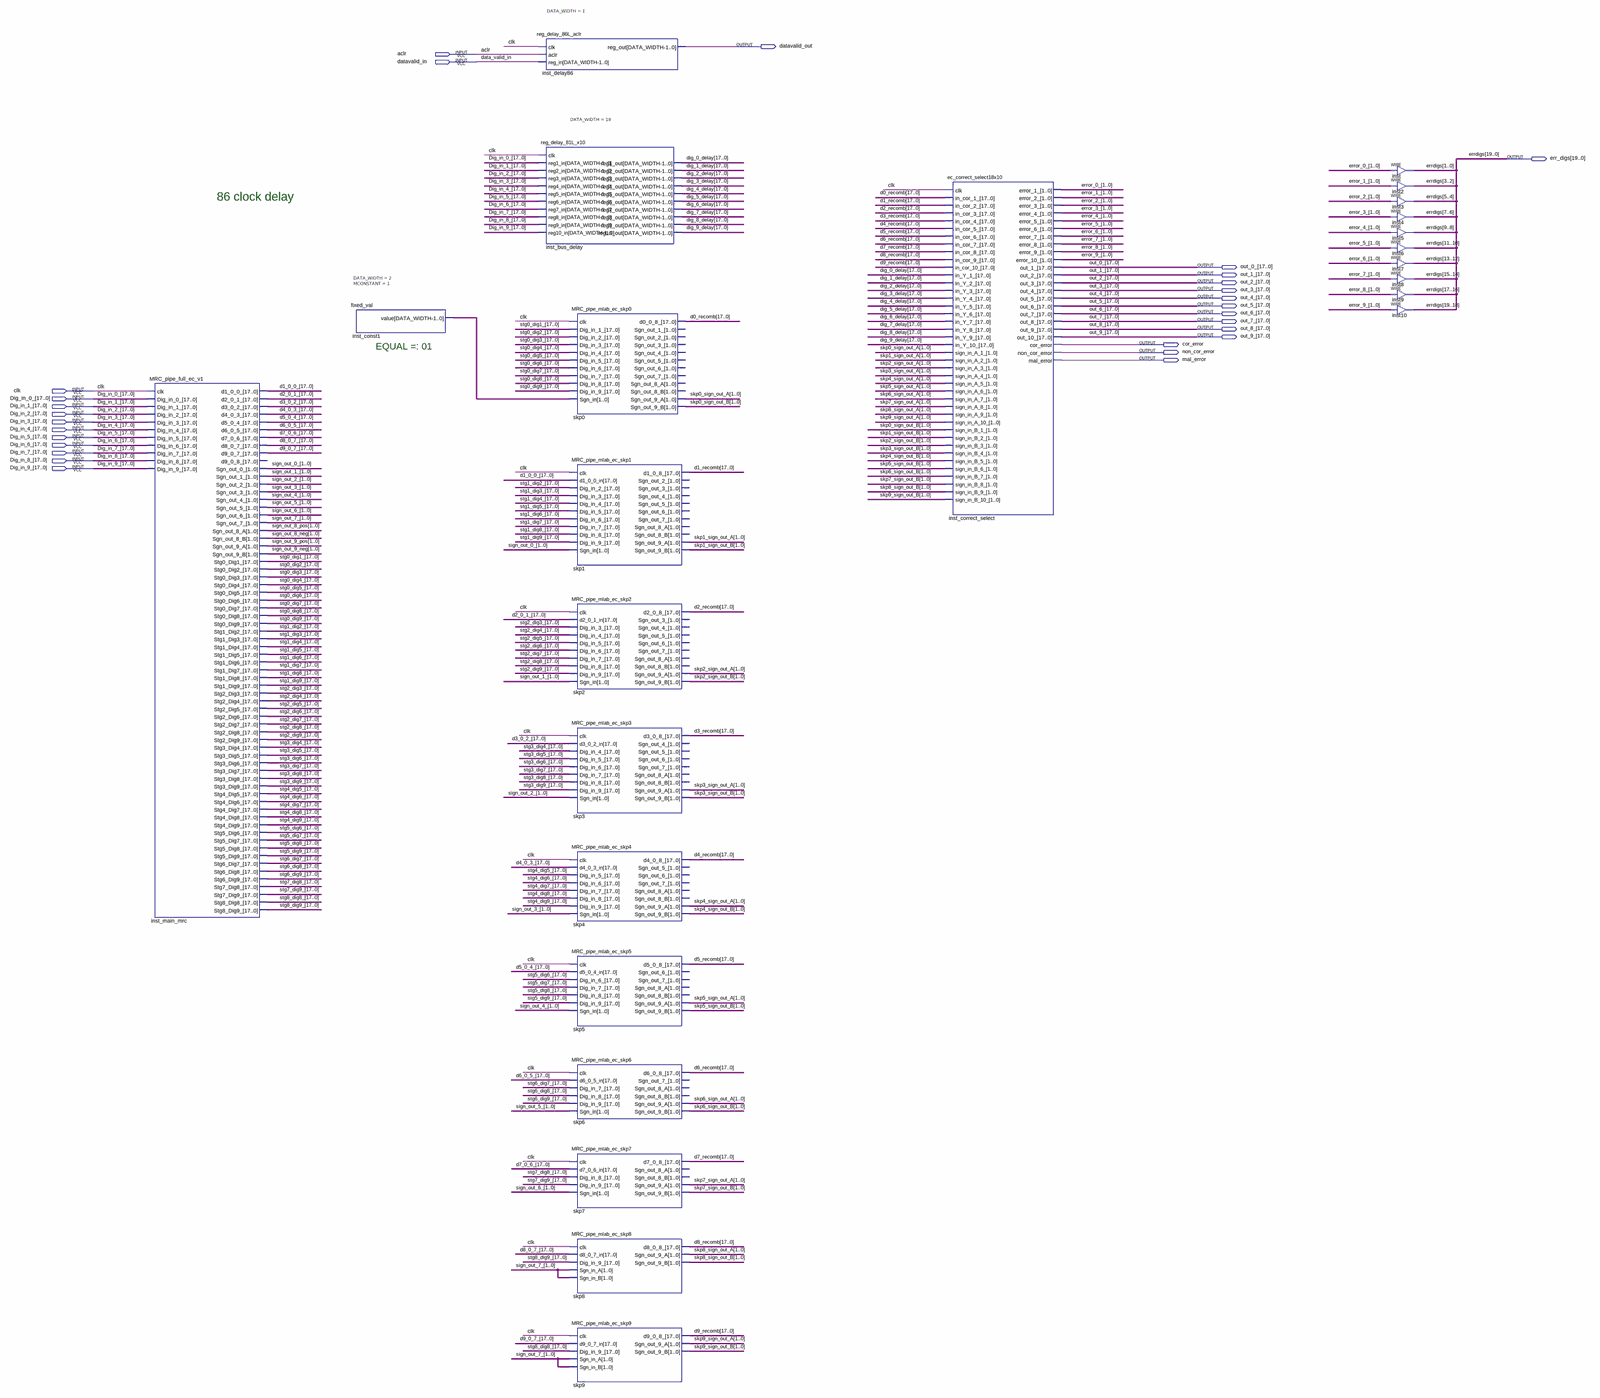
[diagram p0: schematic sheet, whole]
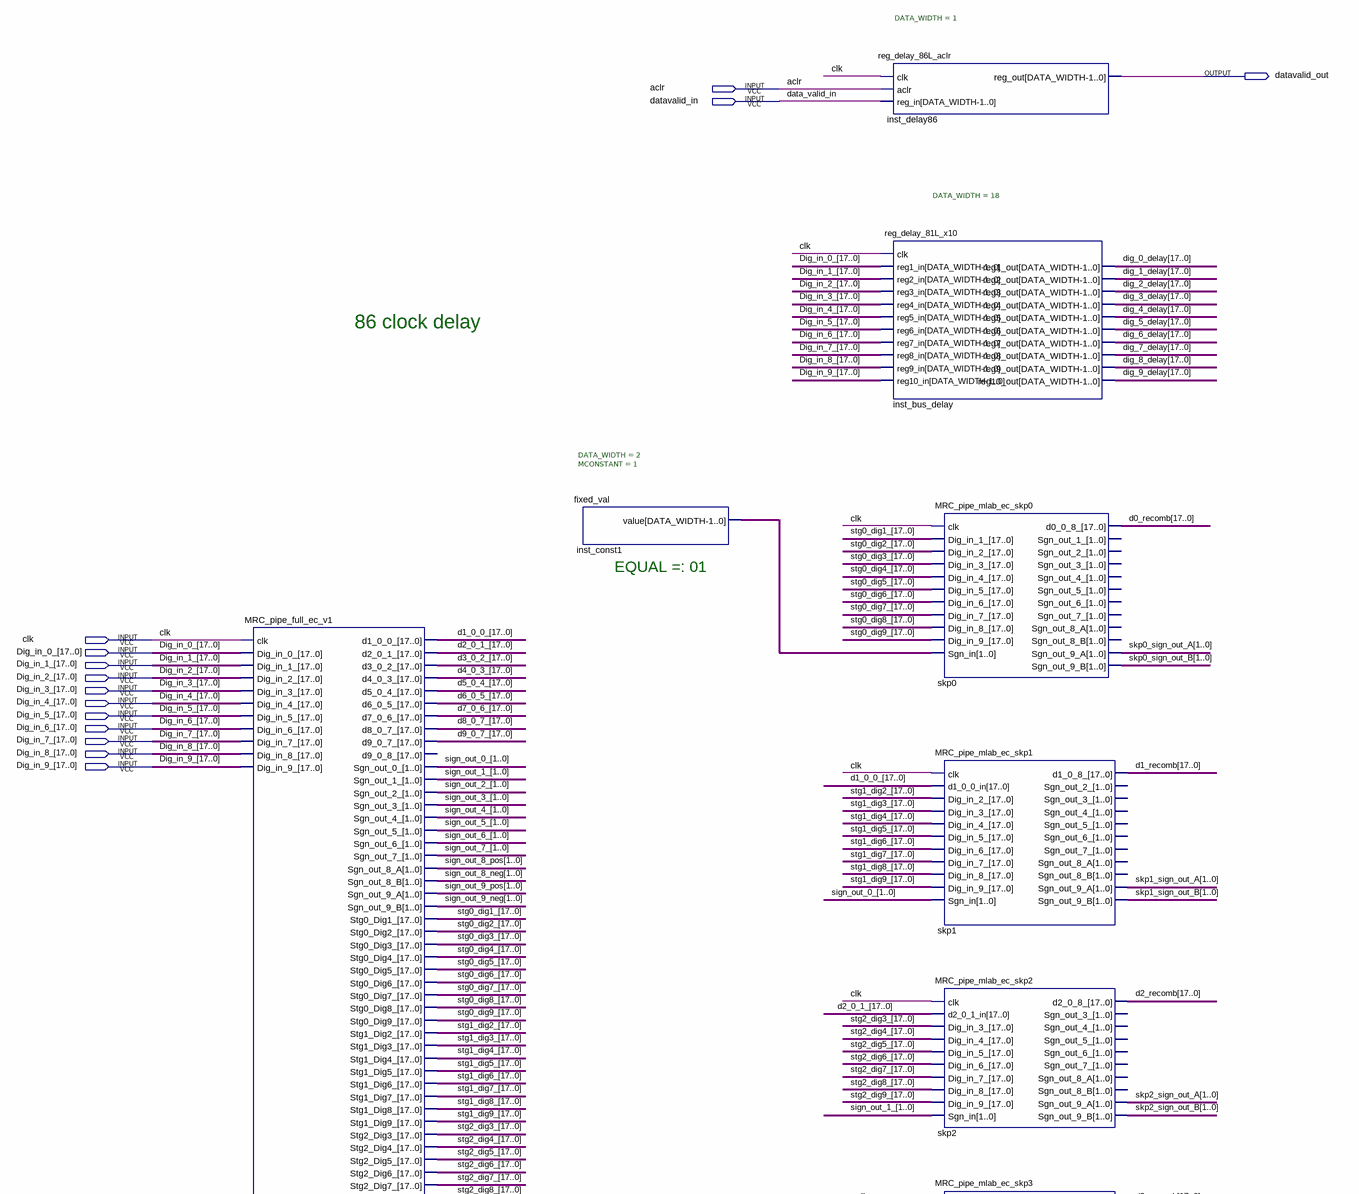
[diagram p1: schematic sheet, upper left part]
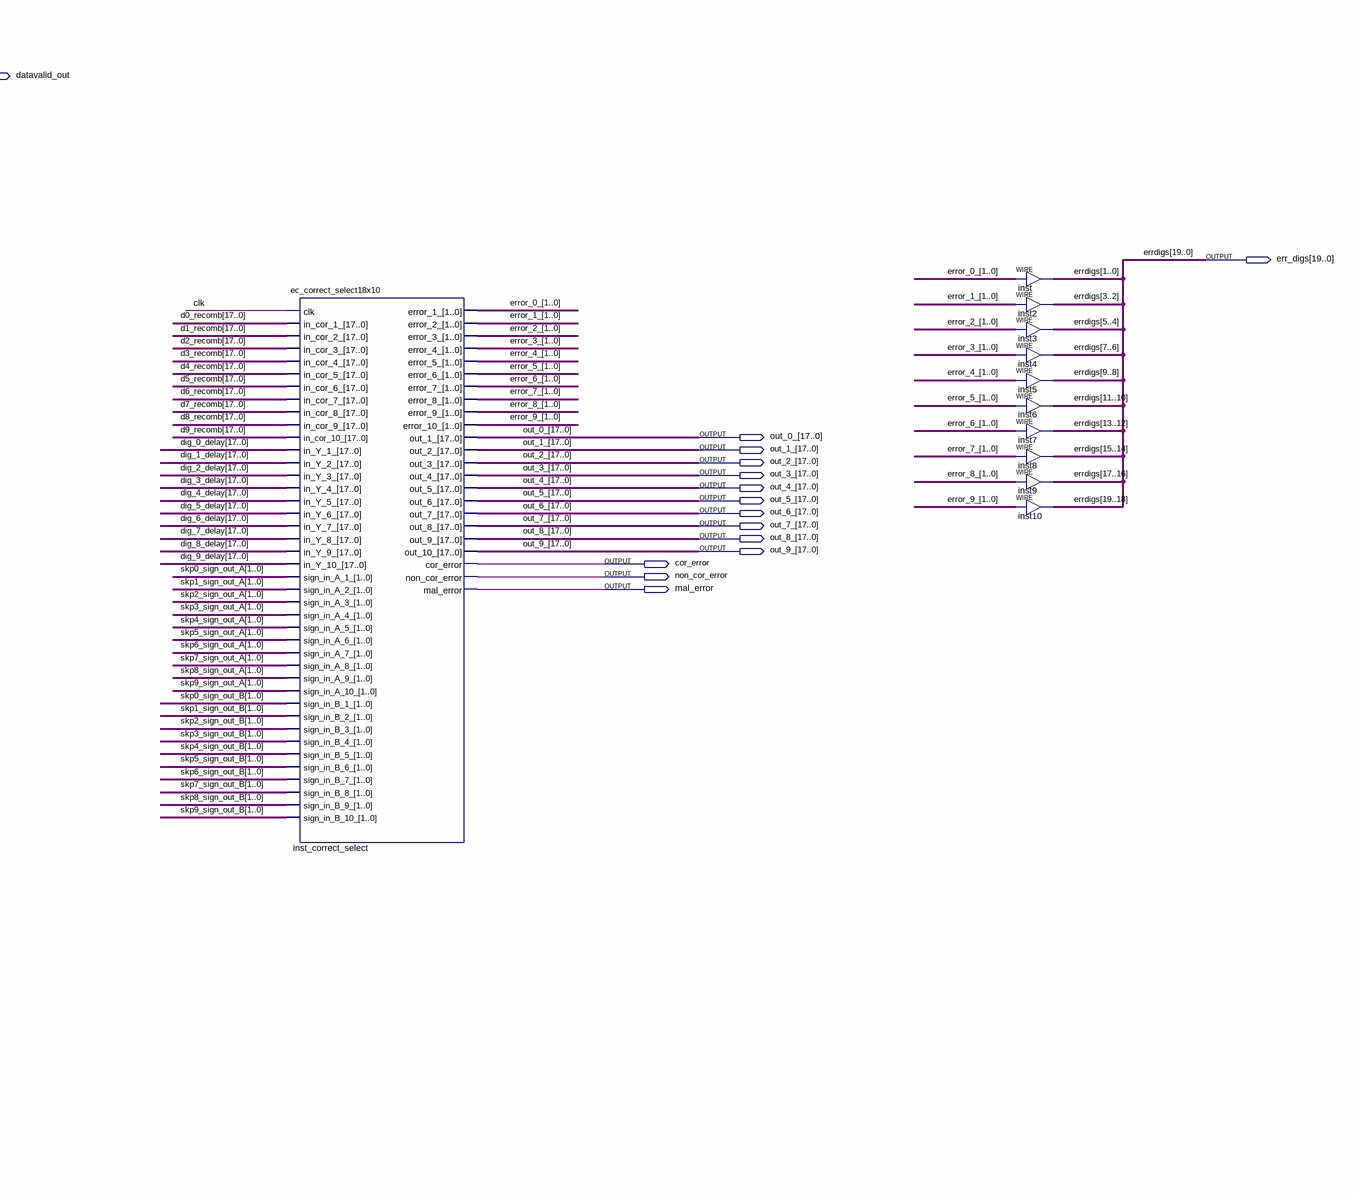
[diagram p2: schematic sheet, upper right part]
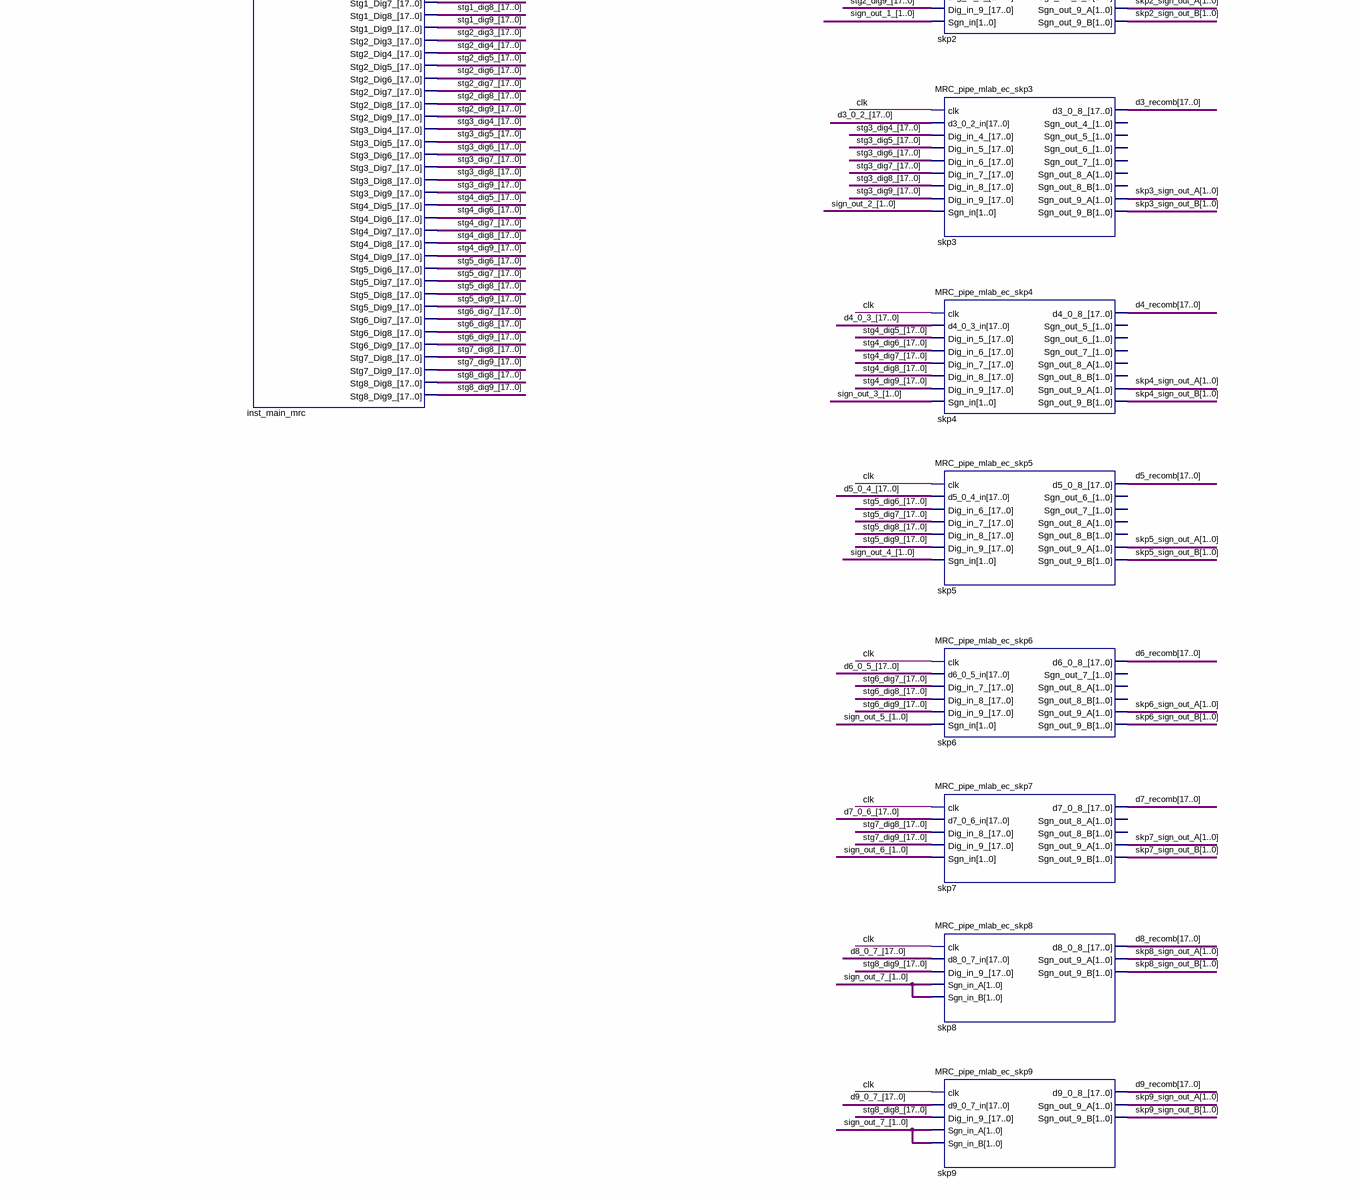
[diagram p3: schematic sheet, lower left part]
// Quartus schematic ec_correct_pipe18x10_dval_errdigs.bdf as structural Verilog: 25 symbols, 28 pins
module ec_correct_pipe18x10_dval_errdigs (
  input  aclr,
  input  datavalid_in,
  input  clk,
  input  [17:0] Dig_in_0_,
  input  [17:0] Dig_in_1_,
  input  [17:0] Dig_in_2_,
  input  [17:0] Dig_in_3_,
  input  [17:0] Dig_in_4_,
  input  [17:0] Dig_in_5_,
  input  [17:0] Dig_in_6_,
  input  [17:0] Dig_in_7_,
  input  [17:0] Dig_in_8_,
  input  [17:0] Dig_in_9_,
  output datavalid_out,
  output [19:0] err_digs,
  output [17:0] out_0_,
  output [17:0] out_1_,
  output [17:0] out_2_,
  output [17:0] out_3_,
  output [17:0] out_4_,
  output [17:0] out_5_,
  output [17:0] out_6_,
  output [17:0] out_7_,
  output [17:0] out_8_,
  output [17:0] out_9_,
  output cor_error,
  output non_cor_error,
  output mal_error
);

  wire [1:0] error_0_, error_1_, error_2_, error_3_, error_4_, error_5_, error_6_, error_7_, error_8_,
       error_9_, inst_const1_value, sign_out_0_, sign_out_1_, sign_out_2_, sign_out_3_, sign_out_4_,
       sign_out_5_, sign_out_6_, sign_out_7_, sign_out_8_neg, sign_out_8_pos, sign_out_9_neg, sign_out_9_pos,
       skp0_sign_out_A, skp0_sign_out_B, skp1_sign_out_A, skp1_sign_out_B, skp2_sign_out_A, skp2_sign_out_B,
       skp3_sign_out_A, skp3_sign_out_B, skp4_sign_out_A, skp4_sign_out_B, skp5_sign_out_A, skp5_sign_out_B,
       skp6_sign_out_A, skp6_sign_out_B, skp7_sign_out_A, skp7_sign_out_B, skp8_sign_out_A, skp8_sign_out_B,
       skp9_sign_out_A, skp9_sign_out_B;
  wire [17:0] d0_recomb, d1_0_0_, d1_recomb, d2_0_1_, d2_recomb, d3_0_2_, d3_recomb, d4_0_3_, d4_recomb,
       d5_0_4_, d5_recomb, d6_0_5_, d6_recomb, d7_0_6_, d7_recomb, d8_0_7_, d8_recomb, d9_0_7_, d9_recomb,
       dig_0_delay, dig_1_delay, dig_2_delay, dig_3_delay, dig_4_delay, dig_5_delay, dig_6_delay,
       dig_7_delay, dig_8_delay, dig_9_delay, stg0_dig1_, stg0_dig2_, stg0_dig3_, stg0_dig4_, stg0_dig5_,
       stg0_dig6_, stg0_dig7_, stg0_dig8_, stg0_dig9_, stg1_dig2_, stg1_dig3_, stg1_dig4_, stg1_dig5_,
       stg1_dig6_, stg1_dig7_, stg1_dig8_, stg1_dig9_, stg2_dig3_, stg2_dig4_, stg2_dig5_, stg2_dig6_,
       stg2_dig7_, stg2_dig8_, stg2_dig9_, stg3_dig4_, stg3_dig5_, stg3_dig6_, stg3_dig7_, stg3_dig8_,
       stg3_dig9_, stg4_dig5_, stg4_dig6_, stg4_dig7_, stg4_dig8_, stg4_dig9_, stg5_dig6_, stg5_dig7_,
       stg5_dig8_, stg5_dig9_, stg6_dig7_, stg6_dig8_, stg6_dig9_, stg7_dig8_, stg7_dig9_, stg8_dig8_,
       stg8_dig9_;

  MRC_pipe_full_ec_v1 inst_main_mrc (
    .clk(clk), .Dig_in_0_(Dig_in_0_), .Dig_in_1_(Dig_in_1_), .Dig_in_2_(Dig_in_2_), .Dig_in_3_(Dig_in_3_),
    .Dig_in_4_(Dig_in_4_), .Dig_in_5_(Dig_in_5_), .Dig_in_6_(Dig_in_6_), .Dig_in_7_(Dig_in_7_),
    .Dig_in_8_(Dig_in_8_), .Dig_in_9_(Dig_in_9_), .d1_0_0_(d1_0_0_), .d2_0_1_(d2_0_1_), .d3_0_2_(d3_0_2_),
    .d4_0_3_(d4_0_3_), .d5_0_4_(d5_0_4_), .d6_0_5_(d6_0_5_), .d7_0_6_(d7_0_6_), .d8_0_7_(d8_0_7_),
    .d9_0_7_(d9_0_7_), .Sgn_out_0_(sign_out_0_), .Sgn_out_1_(sign_out_1_), .Sgn_out_2_(sign_out_2_),
    .Sgn_out_3_(sign_out_3_), .Sgn_out_4_(sign_out_4_), .Sgn_out_5_(sign_out_5_), .Sgn_out_6_(sign_out_6_),
    .Sgn_out_7_(sign_out_7_), .Sgn_out_8_A(sign_out_8_pos), .Sgn_out_8_B(sign_out_8_neg),
    .Sgn_out_9_A(sign_out_9_pos), .Sgn_out_9_B(sign_out_9_neg), .Stg0_Dig1_(stg0_dig1_),
    .Stg0_Dig2_(stg0_dig2_), .Stg0_Dig3_(stg0_dig3_), .Stg0_Dig4_(stg0_dig4_), .Stg0_Dig5_(stg0_dig5_),
    .Stg0_Dig6_(stg0_dig6_), .Stg0_Dig7_(stg0_dig7_), .Stg0_Dig8_(stg0_dig8_), .Stg0_Dig9_(stg0_dig9_),
    .Stg1_Dig2_(stg1_dig2_), .Stg1_Dig3_(stg1_dig3_), .Stg1_Dig4_(stg1_dig4_), .Stg1_Dig5_(stg1_dig5_),
    .Stg1_Dig6_(stg1_dig6_), .Stg1_Dig7_(stg1_dig7_), .Stg1_Dig8_(stg1_dig8_), .Stg1_Dig9_(stg1_dig9_),
    .Stg2_Dig3_(stg2_dig3_), .Stg2_Dig4_(stg2_dig4_), .Stg2_Dig5_(stg2_dig5_), .Stg2_Dig6_(stg2_dig6_),
    .Stg2_Dig7_(stg2_dig7_), .Stg2_Dig8_(stg2_dig8_), .Stg2_Dig9_(stg2_dig9_), .Stg3_Dig4_(stg3_dig4_),
    .Stg3_Dig5_(stg3_dig5_), .Stg3_Dig6_(stg3_dig6_), .Stg3_Dig7_(stg3_dig7_), .Stg3_Dig8_(stg3_dig8_),
    .Stg3_Dig9_(stg3_dig9_), .Stg4_Dig5_(stg4_dig5_), .Stg4_Dig6_(stg4_dig6_), .Stg4_Dig7_(stg4_dig7_),
    .Stg4_Dig8_(stg4_dig8_), .Stg4_Dig9_(stg4_dig9_), .Stg5_Dig6_(stg5_dig6_), .Stg5_Dig7_(stg5_dig7_),
    .Stg5_Dig8_(stg5_dig8_), .Stg5_Dig9_(stg5_dig9_), .Stg6_Dig7_(stg6_dig7_), .Stg6_Dig8_(stg6_dig8_),
    .Stg6_Dig9_(stg6_dig9_), .Stg7_Dig8_(stg7_dig8_), .Stg7_Dig9_(stg7_dig9_), .Stg8_Dig8_(stg8_dig8_),
    .Stg8_Dig9_(stg8_dig9_));  // open: d9_0_8_
  fixed_val #(.DATA_WIDTH(2), .MCONSTANT(1)) inst_const1 (.value(inst_const1_value));
  reg_delay_86L_aclr #(.DATA_WIDTH(1)) inst_delay86 (
    .clk(clk), .aclr(aclr), .reg_in(datavalid_in), .reg_out(datavalid_out));
  reg_delay_81L_x10 #(.DATA_WIDTH(18)) inst_bus_delay (
    .clk(clk), .reg10_in(Dig_in_9_), .reg1_in(Dig_in_0_), .reg2_in(Dig_in_1_), .reg3_in(Dig_in_2_),
    .reg4_in(Dig_in_3_), .reg5_in(Dig_in_4_), .reg6_in(Dig_in_5_), .reg7_in(Dig_in_6_), .reg8_in(Dig_in_7_),
    .reg9_in(Dig_in_8_), .reg10_out(dig_9_delay), .reg1_out(dig_0_delay), .reg2_out(dig_1_delay),
    .reg3_out(dig_2_delay), .reg4_out(dig_3_delay), .reg5_out(dig_4_delay), .reg6_out(dig_5_delay),
    .reg7_out(dig_6_delay), .reg8_out(dig_7_delay), .reg9_out(dig_8_delay));
  MRC_pipe_mlab_ec_skp0 skp0 (
    .clk(clk), .Dig_in_1_(stg0_dig1_), .Dig_in_2_(stg0_dig2_), .Dig_in_3_(stg0_dig3_),
    .Dig_in_4_(stg0_dig4_), .Dig_in_5_(stg0_dig5_), .Dig_in_6_(stg0_dig6_), .Dig_in_7_(stg0_dig7_),
    .Dig_in_8_(stg0_dig8_), .Dig_in_9_(stg0_dig9_), .Sgn_in(inst_const1_value), .d0_0_8_(d0_recomb),
    .Sgn_out_9_A(skp0_sign_out_A), .Sgn_out_9_B(skp0_sign_out_B));  // open: Sgn_out_1_, Sgn_out_2_, Sgn_out_3_, Sgn_out_4_, Sgn_out_5_, Sgn_out_6_, Sgn_out_7_, Sgn_out_8_A, Sgn_out_8_B
  MRC_pipe_mlab_ec_skp1 skp1 (
    .clk(clk), .d1_0_0_in(d1_0_0_), .Dig_in_2_(stg1_dig2_), .Dig_in_3_(stg1_dig3_), .Dig_in_4_(stg1_dig4_),
    .Dig_in_5_(stg1_dig5_), .Dig_in_6_(stg1_dig6_), .Dig_in_7_(stg1_dig7_), .Dig_in_8_(stg1_dig8_),
    .Dig_in_9_(stg1_dig9_), .Sgn_in(sign_out_0_), .d1_0_8_(d1_recomb), .Sgn_out_9_A(skp1_sign_out_A),
    .Sgn_out_9_B(skp1_sign_out_B));  // open: Sgn_out_2_, Sgn_out_3_, Sgn_out_4_, Sgn_out_5_, Sgn_out_6_, Sgn_out_7_, Sgn_out_8_A, Sgn_out_8_B
  MRC_pipe_mlab_ec_skp2 skp2 (
    .clk(clk), .d2_0_1_in(d2_0_1_), .Dig_in_3_(stg2_dig3_), .Dig_in_4_(stg2_dig4_), .Dig_in_5_(stg2_dig5_),
    .Dig_in_6_(stg2_dig6_), .Dig_in_7_(stg2_dig7_), .Dig_in_8_(stg2_dig8_), .Dig_in_9_(stg2_dig9_),
    .Sgn_in(sign_out_1_), .d2_0_8_(d2_recomb), .Sgn_out_9_A(skp2_sign_out_A), .Sgn_out_9_B(skp2_sign_out_B));  // open: Sgn_out_3_, Sgn_out_4_, Sgn_out_5_, Sgn_out_6_, Sgn_out_7_, Sgn_out_8_A, Sgn_out_8_B
  MRC_pipe_mlab_ec_skp3 skp3 (
    .clk(clk), .d3_0_2_in(d3_0_2_), .Dig_in_4_(stg3_dig4_), .Dig_in_5_(stg3_dig5_), .Dig_in_6_(stg3_dig6_),
    .Dig_in_7_(stg3_dig7_), .Dig_in_8_(stg3_dig8_), .Dig_in_9_(stg3_dig9_), .Sgn_in(sign_out_2_),
    .d3_0_8_(d3_recomb), .Sgn_out_9_A(skp3_sign_out_A), .Sgn_out_9_B(skp3_sign_out_B));  // open: Sgn_out_4_, Sgn_out_5_, Sgn_out_6_, Sgn_out_7_, Sgn_out_8_A, Sgn_out_8_B
  MRC_pipe_mlab_ec_skp4 skp4 (
    .clk(clk), .d4_0_3_in(d4_0_3_), .Dig_in_5_(stg4_dig5_), .Dig_in_6_(stg4_dig6_), .Dig_in_7_(stg4_dig7_),
    .Dig_in_8_(stg4_dig8_), .Dig_in_9_(stg4_dig9_), .Sgn_in(sign_out_3_), .d4_0_8_(d4_recomb),
    .Sgn_out_9_A(skp4_sign_out_A), .Sgn_out_9_B(skp4_sign_out_B));  // open: Sgn_out_5_, Sgn_out_6_, Sgn_out_7_, Sgn_out_8_A, Sgn_out_8_B
  MRC_pipe_mlab_ec_skp5 skp5 (
    .clk(clk), .d5_0_4_in(d5_0_4_), .Dig_in_6_(stg5_dig6_), .Dig_in_7_(stg5_dig7_), .Dig_in_8_(stg5_dig8_),
    .Dig_in_9_(stg5_dig9_), .Sgn_in(sign_out_4_), .d5_0_8_(d5_recomb), .Sgn_out_9_A(skp5_sign_out_A),
    .Sgn_out_9_B(skp5_sign_out_B));  // open: Sgn_out_6_, Sgn_out_7_, Sgn_out_8_A, Sgn_out_8_B
  MRC_pipe_mlab_ec_skp6 skp6 (
    .clk(clk), .d6_0_5_in(d6_0_5_), .Dig_in_7_(stg6_dig7_), .Dig_in_8_(stg6_dig8_), .Dig_in_9_(stg6_dig9_),
    .Sgn_in(sign_out_5_), .d6_0_8_(d6_recomb), .Sgn_out_9_A(skp6_sign_out_A), .Sgn_out_9_B(skp6_sign_out_B));  // open: Sgn_out_7_, Sgn_out_8_A, Sgn_out_8_B
  MRC_pipe_mlab_ec_skp7 skp7 (
    .clk(clk), .d7_0_6_in(d7_0_6_), .Dig_in_8_(stg7_dig8_), .Dig_in_9_(stg7_dig9_), .Sgn_in(sign_out_6_),
    .d7_0_8_(d7_recomb), .Sgn_out_9_A(skp7_sign_out_A), .Sgn_out_9_B(skp7_sign_out_B));  // open: Sgn_out_8_A, Sgn_out_8_B
  MRC_pipe_mlab_ec_skp8 skp8 (
    .clk(clk), .d8_0_7_in(d8_0_7_), .Dig_in_9_(stg8_dig9_), .Sgn_in_A(sign_out_7_), .Sgn_in_B(sign_out_7_),
    .d8_0_8_(d8_recomb), .Sgn_out_9_A(skp8_sign_out_A), .Sgn_out_9_B(skp8_sign_out_B));
  MRC_pipe_mlab_ec_skp9 skp9 (
    .clk(clk), .d9_0_7_in(d9_0_7_), .Dig_in_9_(stg8_dig8_), .Sgn_in_A(sign_out_7_), .Sgn_in_B(sign_out_7_),
    .d9_0_8_(d9_recomb), .Sgn_out_9_A(skp9_sign_out_A), .Sgn_out_9_B(skp9_sign_out_B));
  ec_correct_select18x10 inst_correct_select (
    .clk(clk), .in_cor_1_(d0_recomb), .in_cor_2_(d1_recomb), .in_cor_3_(d2_recomb), .in_cor_4_(d3_recomb),
    .in_cor_5_(d4_recomb), .in_cor_6_(d5_recomb), .in_cor_7_(d6_recomb), .in_cor_8_(d7_recomb),
    .in_cor_9_(d8_recomb), .in_cor_10_(d9_recomb), .in_Y_1_(dig_0_delay), .in_Y_2_(dig_1_delay),
    .in_Y_3_(dig_2_delay), .in_Y_4_(dig_3_delay), .in_Y_5_(dig_4_delay), .in_Y_6_(dig_5_delay),
    .in_Y_7_(dig_6_delay), .in_Y_8_(dig_7_delay), .in_Y_9_(dig_8_delay), .in_Y_10_(dig_9_delay),
    .sign_in_A_1_(skp0_sign_out_A), .sign_in_A_2_(skp1_sign_out_A), .sign_in_A_3_(skp2_sign_out_A),
    .sign_in_A_4_(skp3_sign_out_A), .sign_in_A_5_(skp4_sign_out_A), .sign_in_A_6_(skp5_sign_out_A),
    .sign_in_A_7_(skp6_sign_out_A), .sign_in_A_8_(skp7_sign_out_A), .sign_in_A_9_(skp8_sign_out_A),
    .sign_in_A_10_(skp9_sign_out_A), .sign_in_B_1_(skp0_sign_out_B), .sign_in_B_2_(skp1_sign_out_B),
    .sign_in_B_3_(skp2_sign_out_B), .sign_in_B_4_(skp3_sign_out_B), .sign_in_B_5_(skp4_sign_out_B),
    .sign_in_B_6_(skp5_sign_out_B), .sign_in_B_7_(skp6_sign_out_B), .sign_in_B_8_(skp7_sign_out_B),
    .sign_in_B_9_(skp8_sign_out_B), .sign_in_B_10_(skp9_sign_out_B), .error_1_(error_0_),
    .error_2_(error_1_), .error_3_(error_2_), .error_4_(error_3_), .error_5_(error_4_), .error_6_(error_5_),
    .error_7_(error_6_), .error_8_(error_7_), .error_9_(error_8_), .error_10_(error_9_), .out_1_(out_0_),
    .out_2_(out_1_), .out_3_(out_2_), .out_4_(out_3_), .out_5_(out_4_), .out_6_(out_5_), .out_7_(out_6_),
    .out_8_(out_7_), .out_9_(out_8_), .out_10_(out_9_), .cor_error(cor_error), .non_cor_error(non_cor_error),
    .mal_error(mal_error));
  assign err_digs[1:0] = error_0_;  // WIRE inst
  assign err_digs[3:2] = error_1_;  // WIRE inst2
  assign err_digs[5:4] = error_2_;  // WIRE inst3
  assign err_digs[7:6] = error_3_;  // WIRE inst4
  assign err_digs[9:8] = error_4_;  // WIRE inst5
  assign err_digs[11:10] = error_5_;  // WIRE inst6
  assign err_digs[13:12] = error_6_;  // WIRE inst7
  assign err_digs[15:14] = error_7_;  // WIRE inst8
  assign err_digs[17:16] = error_8_;  // WIRE inst9
  assign err_digs[19:18] = error_9_;  // WIRE inst10

  // Other names for the same wires on the sheet: data_valid_in = datavalid_in; errdigs[19:0] = err_digs

  // Notes on the sheet:
  //   86 clock delay
  //   EQUAL =: 01
endmodule
